# Altium schematic sheet 通讯外设.SchDoc
size A3
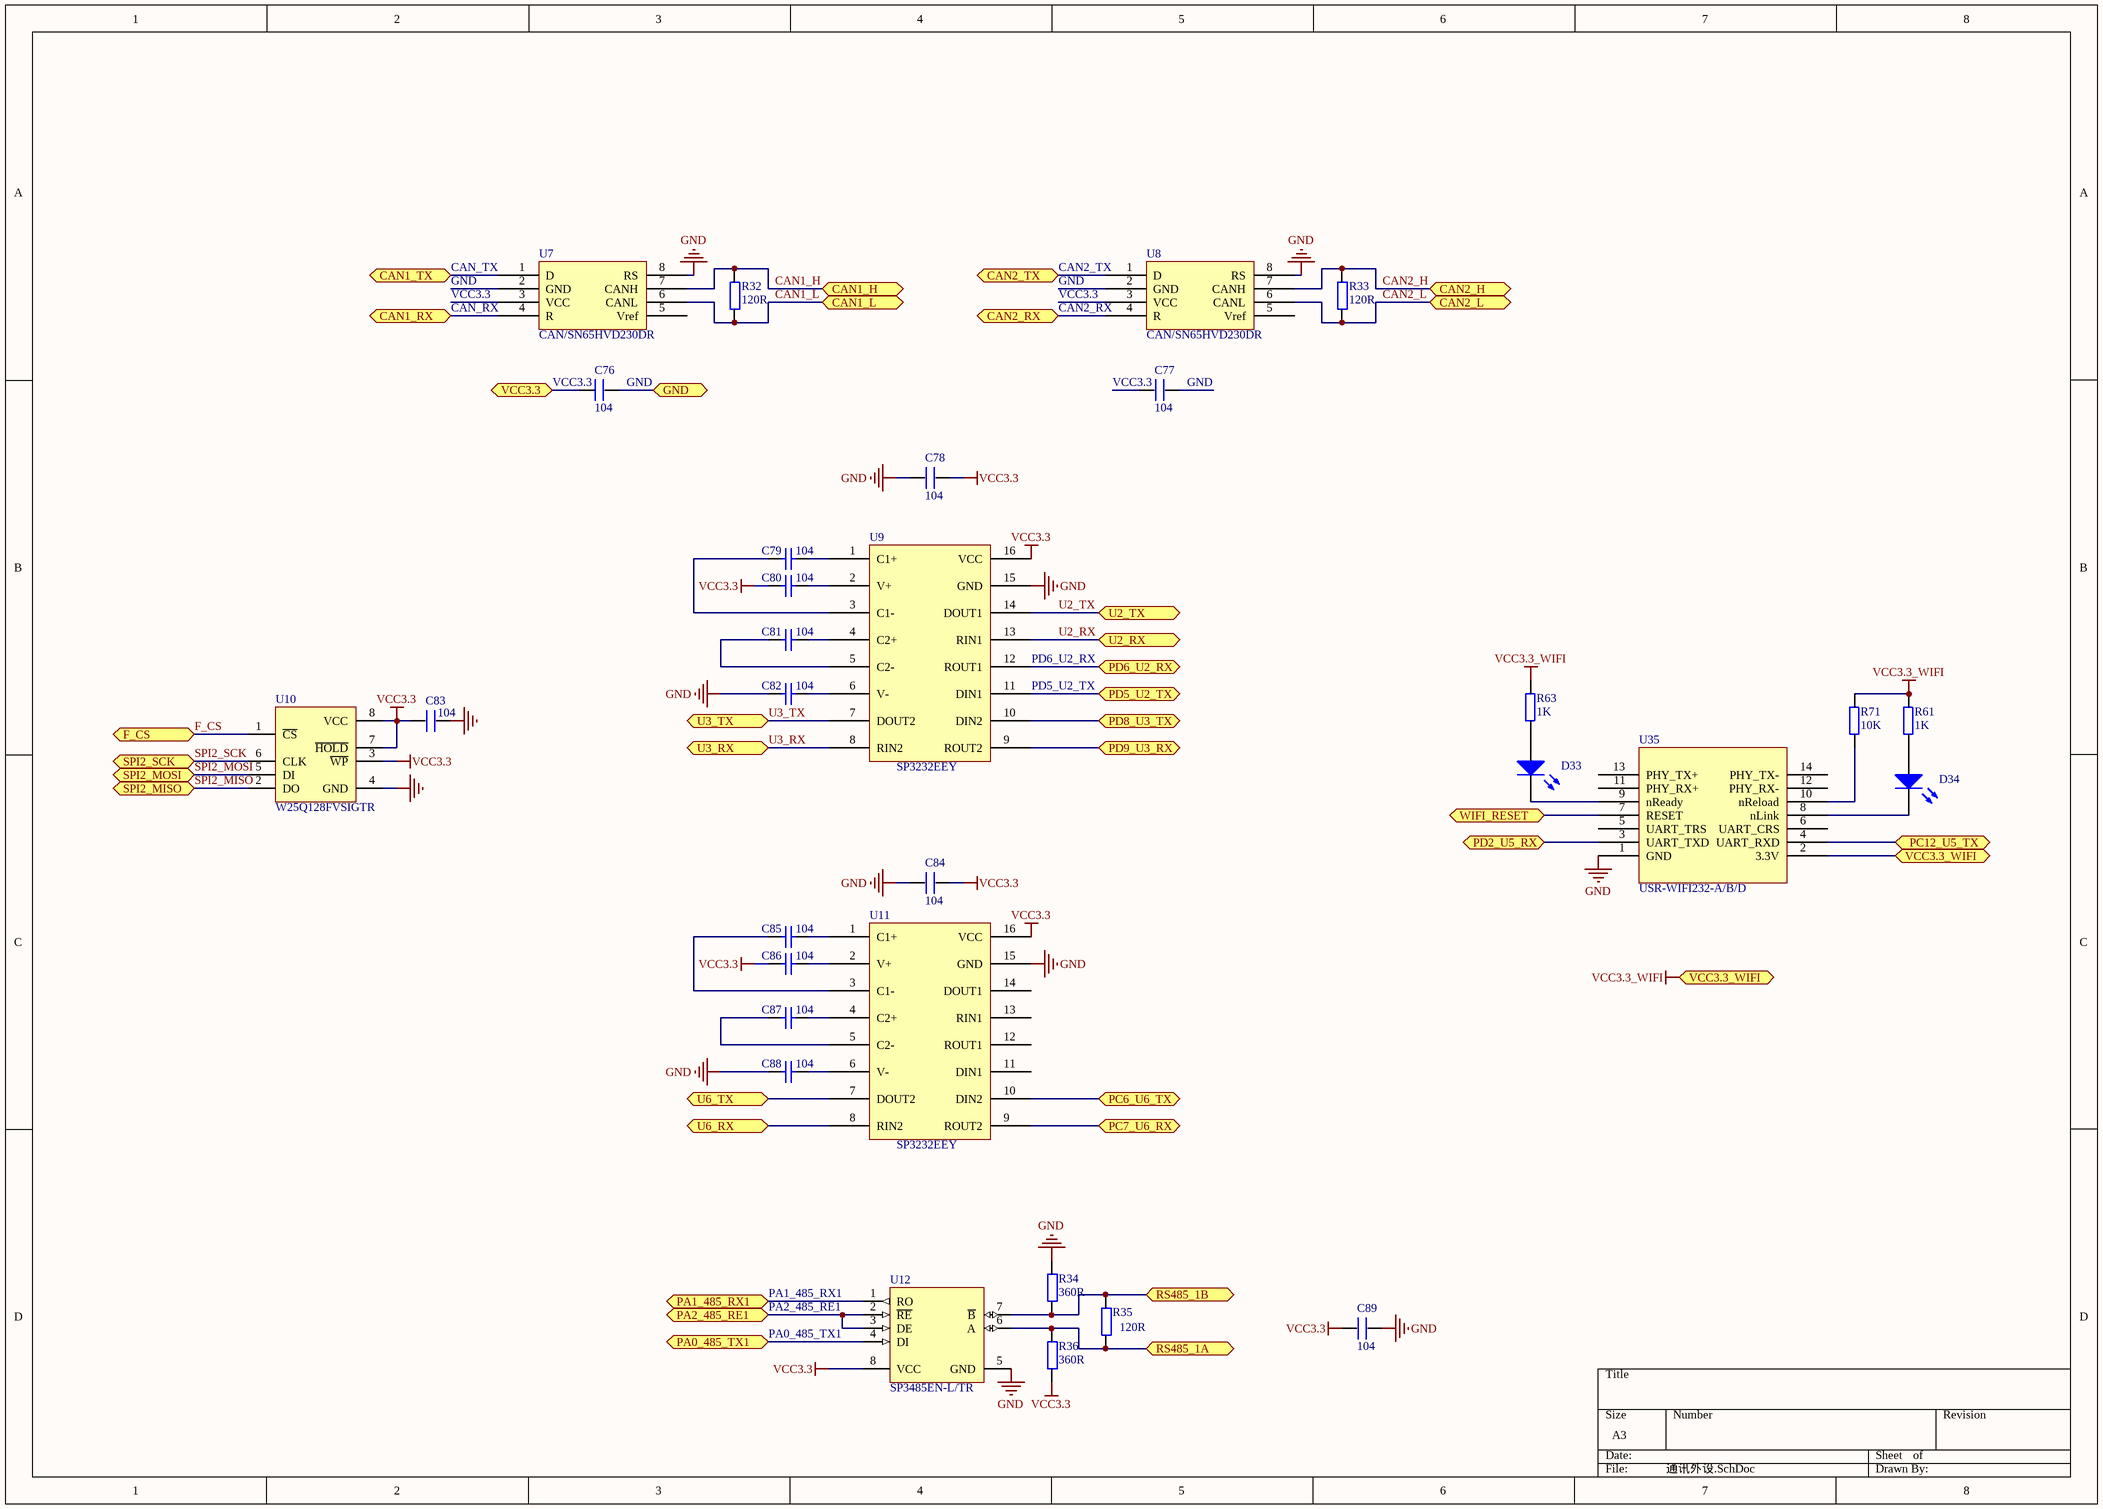
[diagram p0: 通讯外设.SchDoc]

## Parts
C76  104  [0603_C]
C77  104  [0603_C]
C78  104  [0603_C]
C79  value 104  [0603_C]  (hidden comment: 0.1uF)
C80  value 104  [0603_C]  (hidden comment: 0.1uF)
C81  value 104  [0603_C]  (hidden comment: 0.1uF)
C82  value 104  [0603_C]  (hidden comment: 0.1uF)
C83  104  [0603_C]
C84  104  [0603_C]
C85  value 104  [0603_C]  (hidden comment: 0.1uF)
C86  value 104  [0603_C]  (hidden comment: 0.1uF)
C87  value 104  [0603_C]  (hidden comment: 0.1uF)
C88  value 104  [0603_C]  (hidden comment: 0.1uF)
C89  104  [0603_C]
D33  红灯 0805  [LC-0805_LED_S1]  (value not drawn)
D34  红灯 0805  [LC-0805_LED_S1]  (value not drawn)
R32  120R  [0603_R]
R33  120R  [0603_R]
R34  360R  [0603_R]
R35  120R  [0603_R]
R36  360R  [0603_R]
R61  1K  [0603_R]
R63  1K  [0603_R]
R71  10K  [0603_R]
U7  CAN/SN65HVD230DR  [SOIC-8_150mil]
U8  CAN/SN65HVD230DR  [SOIC-8_150mil]
U9  SP3232EEY  [TSSOP-16]
U10  W25Q128FVSIGTR  [SOIC8_W]
U11  SP3232EEY  [TSSOP-16]
U12  SP3485EN-L/TR  [SOIC-8_150mil]
U35  USR-WIFI232-A/B/D  [USR-WIFI232-A/B/D]

## Ports
CAN1_H, CAN1_L, CAN1_RX, CAN1_TX, CAN2_H, CAN2_L, CAN2_RX, CAN2_TX, F_CS, GND, PA0_485_TX1, PA1_485_RX1, PA2_485_RE1, PC6_U6_TX, PC7_U6_RX, PC12_U5_TX, PD2_U5_RX, PD5_U2_TX, PD6_U2_RX, PD8_U3_TX, PD9_U3_RX, RS485_1A, RS485_1B, SPI2_MISO, SPI2_MOSI, SPI2_SCK, U2_RX, U2_TX, U3_RX, U3_TX, U6_RX, U6_TX, VCC3.3, VCC3.3_WIFI, WIFI_RESET

## Nets
GND: C76.2 C77.2 C78.1 C82.2 C83.2 C84.1 C88.2 C89.2 R34.2 U7.2(GND) U7.8(RS) U8.2(GND) U8.8(RS) U9.15(GND) U10.4(GND) U11.15(GND) U12.5(GND) U35.1(GND) ; port GND
VCC3.3: C76.1 C77.1 C78.2 C80.2 C83.1 C84.2 C86.2 C89.1 R36.1 U7.3(VCC) U8.3(VCC) U9.16(VCC) U10.3(~{WP}) U10.7(~{HOLD}) U10.8(VCC) U11.16(VCC) U12.8(VCC) ; port VCC3.3
VCC3.3_WIFI: R61.1 R63.1 R71.1 U35.2(3.3V) ; port VCC3.3_WIFI
CAN1_H: R32.2 U7.7(CANH) ; port CAN1_H
CAN1_L: R32.1 U7.6(CANL) ; port CAN1_L
CAN2_H: R33.2 U8.7(CANH) ; port CAN2_H
CAN2_L: R33.1 U8.6(CANL) ; port CAN2_L
CAN2_RX: U8.4(R) ; port CAN2_RX
CAN2_TX: U8.1(D) ; port CAN2_TX
CAN_RX: U7.4(R) ; port CAN1_RX
CAN_TX: U7.1(D) ; port CAN1_TX
F_CS: U10.1(~{CS}) ; port F_CS
PA0_485_TX1: U12.4(DI) ; port PA0_485_TX1
PA1_485_RX1: U12.1(RO) ; port PA1_485_RX1
PA2_485_RE1: U12.2(~{RE}) U12.3(DE) ; port PA2_485_RE1
PC6_U6_TX: U11.10(DIN2) ; port PC6_U6_TX
PC7_U6_RX: U11.9(ROUT2) ; port PC7_U6_RX
PC12_U5_TX: U35.4(UART_RXD) ; port PC12_U5_TX
PD2_U5_RX: U35.3(UART_TXD) ; port PD2_U5_RX
PD5_U2_TX: U9.11(DIN1) ; port PD5_U2_TX
PD6_U2_RX: U9.12(ROUT1) ; port PD6_U2_RX
PD8_U3_TX: U9.10(DIN2) ; port PD8_U3_TX
PD9_U3_RX: U9.9(ROUT2) ; port PD9_U3_RX
RS485_1A: R35.1 R36.2 U12.6(A) ; port RS485_1A
RS485_1B: R34.1 R35.2 U12.7(~{B}) ; port RS485_1B
SPI2_MISO: U10.2(DO) ; port SPI2_MISO
SPI2_MOSI: U10.5(DI) ; port SPI2_MOSI
SPI2_SCK: U10.6(CLK) ; port SPI2_SCK
U2_RX: U9.13(RIN1) ; port U2_RX
U2_TX: U9.14(DOUT1) ; port U2_TX
U3_RX: U9.8(RIN2) ; port U3_RX
U3_TX: U9.7(DOUT2) ; port U3_TX
U6_RX: U11.8(RIN2) ; port U6_RX
U6_TX: U11.7(DOUT2) ; port U6_TX
WIFI_RESET: U35.7(RESET) ; port WIFI_RESET
NetC79_1: C79.1 U9.1(C1+)
NetC79_2: C79.2 U9.3(C1-)
NetC80_1: C80.1 U9.2(V+)
NetC81_1: C81.1 U9.4(C2+)
NetC81_2: C81.2 U9.5(C2-)
NetC82_1: C82.1 U9.6(V-)
NetC85_1: C85.1 U11.1(C1+)
NetC85_2: C85.2 U11.3(C1-)
NetC86_1: C86.1 U11.2(V+)
NetC87_1: C87.1 U11.4(C2+)
NetC87_2: C87.2 U11.5(C2-)
NetC88_1: C88.1 U11.6(V-)
NetD33_A: D33.A R63.2
NetD33_K: D33.K U35.9(nReady)
NetD34_A: D34.A R61.2
NetD34_K: D34.K U35.8(nLink)
NetR71_2: R71.2 U35.10(nReload)

Not connected (* = marked no-connect by the designer): U7 5(Vref); U8 5(Vref); U11 11(DIN1) 12(ROUT1) 13(RIN1) 14(DOUT1); U35 5(UART_TRS) 6(UART_CRS) 11(PHY_RX+) 12(PHY_RX-) 13(PHY_TX+) 14(PHY_TX-)

## Library data of the parts
C76 C77 C89 = C_3
C78 C84 = C_2
C79-C82 C85-C88 = Cap: Capacitor; Published: 8-Jun-2000; LatestRevisionDate: 17-Jul-2002; LatestRevisionNote: Re-released for DXP Platform.; PackageReference: RAD-0.3; Publisher: Altium Limited; PackageDescription: Radial Cap, Thru-Hole; 2 Leads; 0.3 in Pin Spacing
C83 = C
D33 D34 = LED0: Typical INFRARED GaAs LED; Published: 8-Jun-2000; LatestRevisionDate: 08-Jul-2005; LatestRevisionNote: Mech Layer 1 removed.; PackageReference: LED-0; Publisher: Altium Limited; PackageDescription: LED; 2 Leads
R32-R36 R61 R63 R71 = R_2
U7 U8 = CAN/SN65HVD230DR: CAN; ComponentLink1Description: 供应商链接; ComponentLink1URL: http://www.szlcsc.com/product/details_12661.html; Package: SOIC-8_150mil; Supplier: LC; SuppliersPartNumber: C12084
U9 U11 = MAX3232CUE: RS232
U10 = W25QXX: Flash ROM; Memory: 64M bit
U12 = SP3485EN-L/TR: RS-485/RS-422; ComponentLink1Description: 供应商链接; ComponentLink1URL: http://www.szlcsc.com/product/details_9482.html; Package: SOIC-8; Supplier: LC; SuppliersPartNumber: C8963